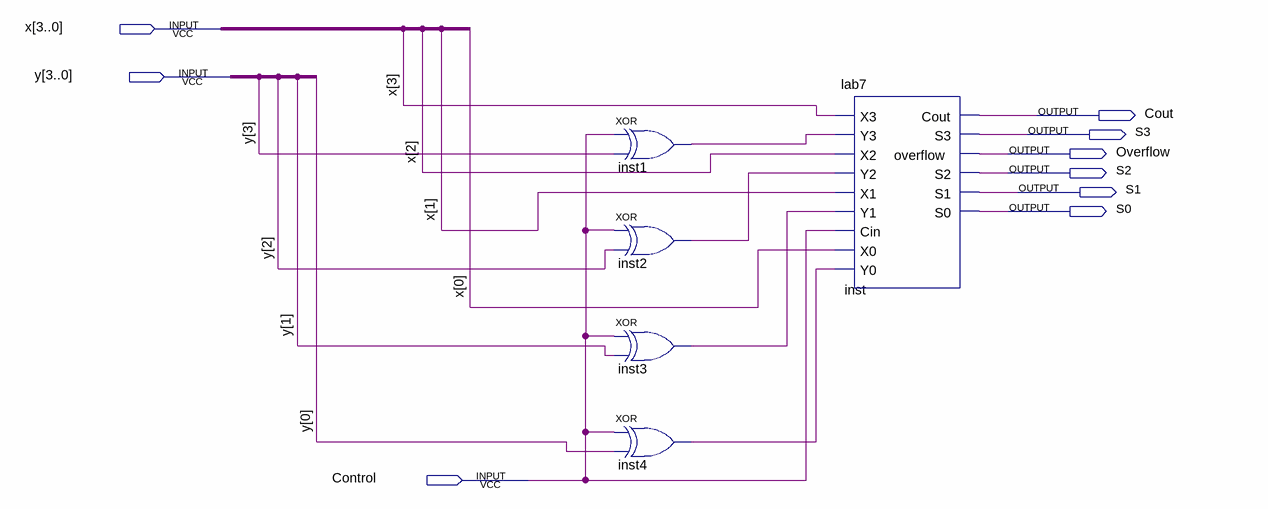
[diagram p0: schematic sheet]
// Quartus schematic add_sub.bdf as structural Verilog: 5 symbols, 9 pins
module add_sub (
  input  [3:0] x,
  input  [3:0] y,
  input  Control,
  output Cout,
  output S3,
  output Overflow,
  output S2,
  output S1,
  output S0
);

  wire inst1_out, inst2_out, inst3_out, inst4_out;

  xor inst1 (inst1_out, Control, y[3]);
  xor inst2 (inst2_out, Control, y[2]);
  xor inst3 (inst3_out, Control, y[1]);
  xor inst4 (inst4_out, Control, y[0]);
  lab7 inst (
    .X3(x[3]), .Y3(inst1_out), .X2(x[2]), .Y2(inst2_out), .X1(x[1]), .Y1(inst3_out), .Cin(Control),
    .X0(x[0]), .Y0(inst4_out), .Cout(Cout), .S3(S3), .overflow(Overflow), .S2(S2), .S1(S1), .S0(S0));
endmodule
